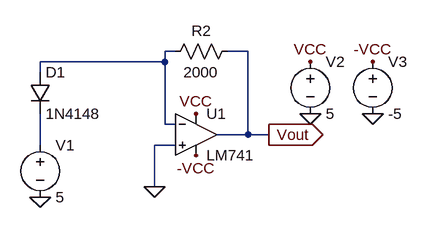
[diagram p0: schematic lab4_task1_part3_2000.asc]
lab4_task1_part3_2000.asc, the LTspice schematic file:
Version 4.1
SHEET 1 880 680
WIRE 112 48 96 48
WIRE 224 48 192 48
WIRE 96 64 96 48
WIRE 96 64 -96 64
WIRE -96 80 -96 64
WIRE 96 160 96 64
WIRE 112 160 96 160
WIRE 224 176 224 48
WIRE 224 176 176 176
WIRE 256 176 224 176
WIRE -96 192 -96 144
WIRE 112 192 80 192
WIRE 80 256 80 192
FLAG -96 272 0
FLAG 320 144 0
FLAG 416 144 0
FLAG 320 64 VCC
FLAG 144 144 VCC
FLAG 416 64 -VCC
FLAG 144 208 -VCC
FLAG 256 176 Vout
IOPIN 256 176 Out
FLAG 80 256 0
SYMBOL res 208 32 R90
WINDOW 0 0 56 VBottom 2
WINDOW 3 32 56 VTop 2
SYMATTR InstName R2
SYMATTR Value 2000
SYMBOL voltage -96 176 R0
WINDOW 123 0 0 Left 0
WINDOW 39 0 0 Left 0
SYMATTR InstName V1
SYMATTR Value 5
SYMBOL voltage 320 48 R0
WINDOW 123 0 0 Left 0
WINDOW 39 0 0 Left 0
SYMATTR InstName V2
SYMATTR Value 5
SYMBOL voltage 416 48 R0
WINDOW 123 0 0 Left 0
WINDOW 39 0 0 Left 0
SYMATTR InstName V3
SYMATTR Value -5
SYMBOL LM741 144 112 R0
SYMATTR InstName U1
SYMBOL diode -112 80 R0
SYMATTR InstName D1
SYMATTR Value 1N4148

The netlist it stands for:
* lab4_task1_part3_2000.asc
R2 Vout N001 2000
V1 N002 0 5
V2 VCC 0 5
V3 -VCC 0 -5
X§U1 0 N001 VCC -VCC Vout LM741  ; pins In+ In- V+ V- OUT
D1 N001 N002 1N4148
.model D D
.lib standard.dio
.lib LM741.lib
.backanno
.end